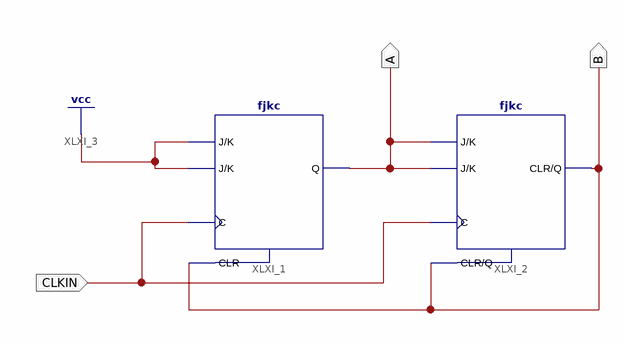
[diagram p0: schematic sheet 1]
// Xilinx ISE schematic flipflop2.sch (spartan6) as structural Verilog: 2 symbols, 3 ports
module flipflop2 (
  input  CLKIN,
  output A,
  output B
);

  fjkc XLXI_1 (.C(CLKIN), .CLR(B), .J(1'b1), .K(1'b1), .Q(A));
  fjkc XLXI_2 (.C(CLKIN), .CLR(B), .J(A), .K(A), .Q(B));
endmodule
